# EasyEDA Pro project ProPrj_100MHz��ѹ���̽ͷ_2024-07-25.epro, board 屏蔽层板
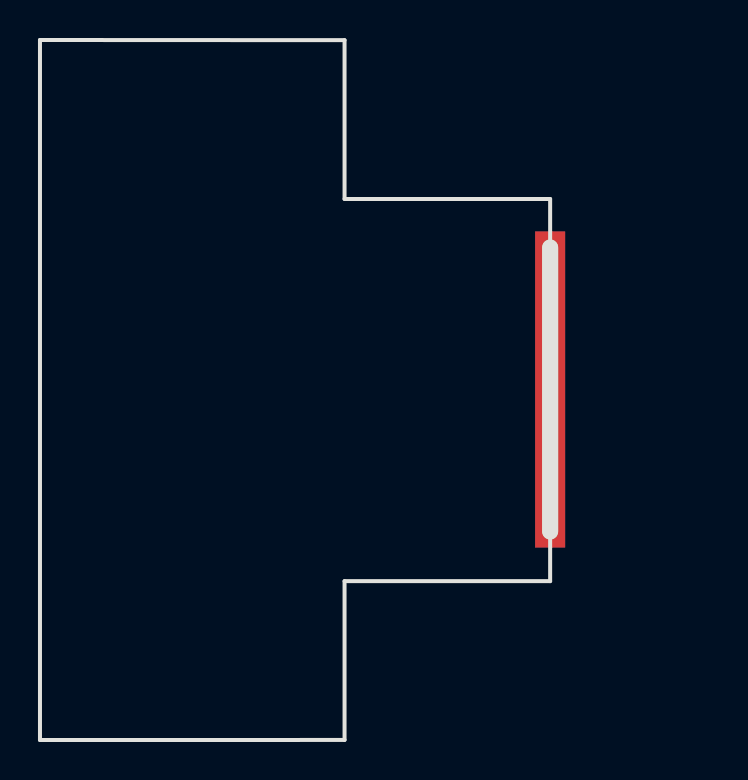
[diagram p10: board, top side]
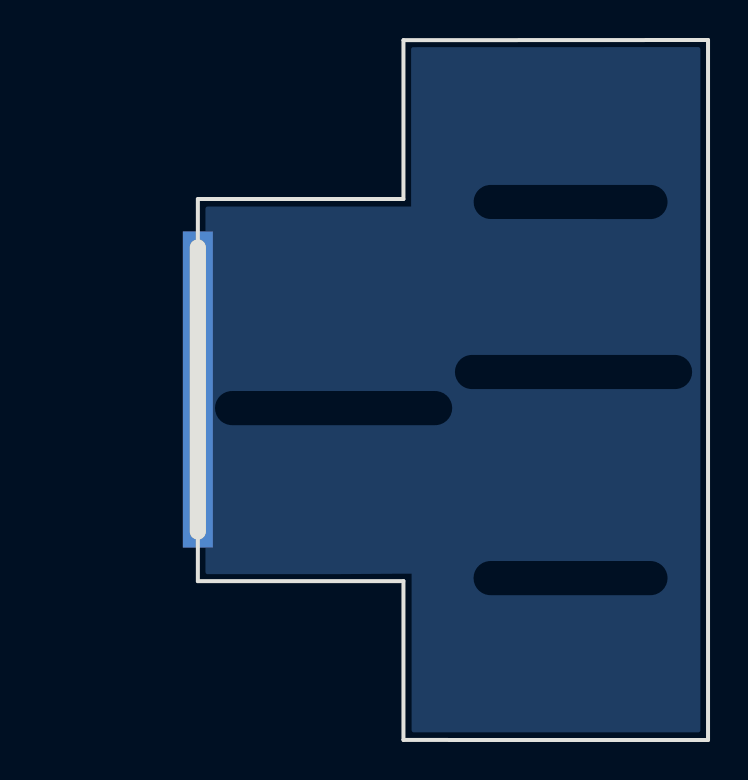
[diagram p11: board, bottom side, seen from below]

Outline 25.53 x 35 mm; copper layers: Top Layer, Bottom Layer. Coordinates in mm from the lower left corner of the outline.
Outline path: 0,35 0,0 15.24,0 15.24,7.94 25.53,7.94 25.53,27.05 15.24,27.05 15.24,34.99 0,35
Stack: Top Layer 0.035mm / Dielectric1 1.51mm FR4 er 4.5 / Bottom Layer 0.035mm

## Design rules (mm)
template: 自定义配置
spacing copperThickness1oz (default): track to track 0.102, other pairs 0.152 to 0.3
spacing copperThickness2oz: track to track 0.203, other pairs 0.152 to 0.3
track width copperThickness1oz (default): min 0.127, default 0.254, max 2.54
track width copperThickness2oz: min 0.203, default 0.254, max 2.54
differential pair differentialPair (default): width min 0.127, default 0.254, max 2.54; gap min 0.152, default 0.152
via viaSize (default): diameter min 0.5, default 0.61, max 10; hole min 0.3, default 0.305, max 6.3

## Placement (name value [footprint] x y rotation side)
NOREF  -  [Pad_e11]  25.53 17.53 90 top

## Footprints (pads in the part's own frame, mm; a bottom-side part is the same pattern mirrored in y, then rotated)
Pad_e11
  rect 15.8x1.5 hole 15x0.8: 1(0,0)

## Nets
00: NOREF.1

## Copper pours and planes (outline as drawn; the poured copper is in the pictures)
00 on Bottom Layer: 0.38,34.67 0.38,0.38 14.83,0.38 14.83,8.32 25.15,8.25 25.15,26.67 14.86,26.67 14.86,34.67
